# EAGLE design clock-kit-board-002 (EAGLE 8.5.2)
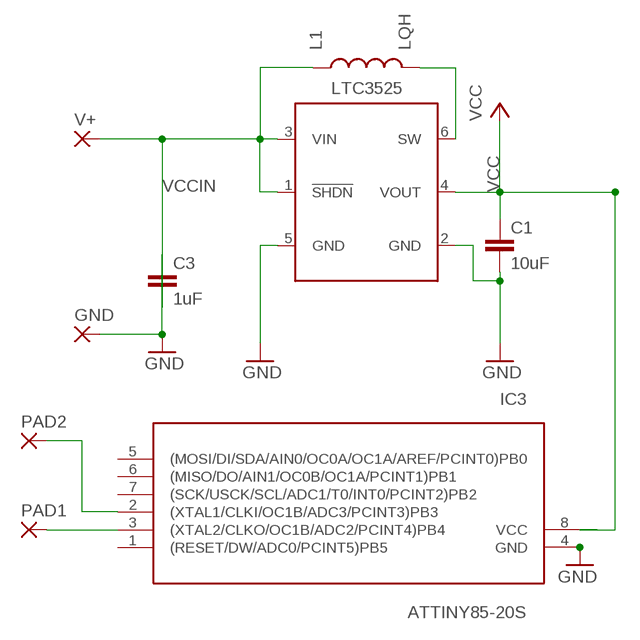
[diagram p0: schematic, sheet 1]

## Parts
C1  10uF  CAP0805  [0805]
C3  1uF  CAP0805  [0805]
GND  SMD5  [SMD2,54-5,08]
IC3  ATTINY85-20S  ATTINY85V-10S  [SOIC8]
L1  LQH  [LQH32]
PAD1  1,6/0,9  [1,6/0,9]
PAD2  1,6/0,9  [1,6/0,9]
U1  LTC3525  [SC70-6L]
V+  SMD5  [SMD2,54-5,08]

## Nets
GND: C1.2 C3.1 GND.1(P) IC3.4(GND) U1.2(GND) U1.5(GND)
N$1: L1.2 U1.6(SW)
N$2: IC3.3((XTAL2/CLKO/OC1B/ADC2/PCINT4)PB4) PAD1.1(P)
N$3: IC3.2((XTAL1/CLKI/OC1B/ADC3/PCINT3)PB3) PAD2.1(P)
VCC: C1.1 IC3.8(VCC) U1.4(VOUT)
VCCIN: C3.2 L1.1 U1.1(!SHDN) U1.3(VIN) V+.1(P)
Unconnected: IC3.1((RESET/DW/ADC0/PCINT5)PB5) IC3.5((MOSI/DI/SDA/AIN0/OC0A/OC1A/AREF/PCINT0)PB0) IC3.6((MISO/DO/AIN1/OC0B/OC1A/PCINT1)PB1) IC3.7((SCK/USCK/SCL/ADC1/T0/INT0/PCINT2)PB2)

## Library data of the parts
C1 C3 = 0-SparkFun:CAP: Capacitor Standard 0603 ceramic capacitor, and 0.1" leaded capacitor.
GND V+ = wirepad:SMD5: SMD PAD
IC3 = avr:ATTINY85: MICROCONTROLLER 8 Kbytes FLASH 512 bytes EEPROM 512 bytes RAM 4-channel 10 bit ADC USI
L1 = murata-inductor:LQH: Murata LQH32 inductor
PAD1 PAD2 = wirepad:1,6/0,9: THROUGH-HOLE PAD
U1 = bicyclelab:LTC3525

## Board
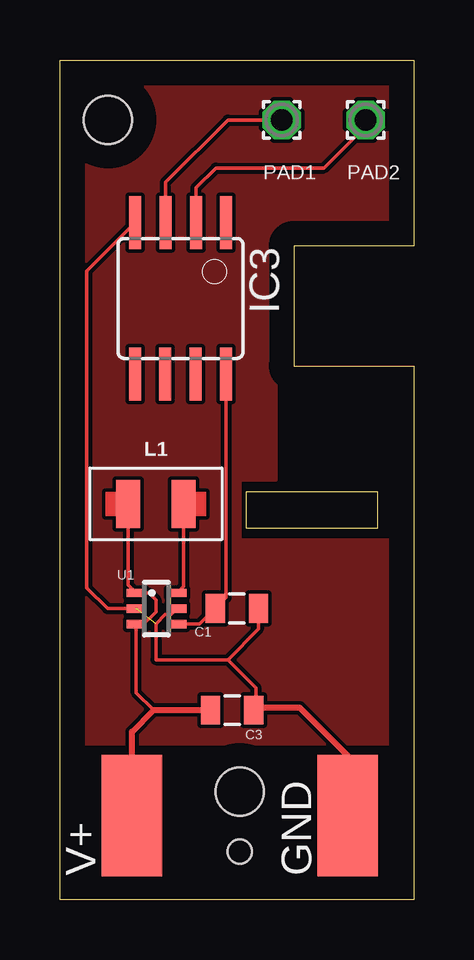
[diagram p1: board, top side]

Size 14.75 x 35 mm. Coordinates in mm from the lower left corner, seen from the top.
Outline: 0,35 14.75,35 14.75,27.25 9.75,27.25 9.75,22.25 14.75,22.25 14.75,0 0,0 0,35
Copper layers (1*16): Top 0.035mm / dielectric 1.5mm / Bottom 0.035mm
Design rules "default": minimum track width 6mil, minimum drill 0.35mm, track to track 6mil, track to pad 6mil, pad to pad 6mil, via to via 6mil, smd to smd 6mil, copper to edge 40mil, drill to drill 6mil, minimum pad ring 10mil, minimum via ring 8mil, stop-mask expansion 4mil, vias tented up to drill 0mil, thermal gap 10mil
Holes 2 mm at 7.5,4.5 2,32.5
Holes 1 mm at 7.5,2
Milling: area 7.8,15.5 to 13.2,17

### Footprints (pad centres in the part's own frame; a part is rotated, then mirrored left to right if it is on the bottom)
0805 = smd 0.8 x 1.2: 1 -0.9,0; 2 0.9,0
SMD2,54-5,08 = smd 2.54 x 5.08: 1 0,0
SOIC8 = smd 0.5 x 2.2: 1 -1.905,-3.154; 2 -0.645,-3.154; 3 0.625,-3.154; 4 1.895,-3.154; 5 1.905,3.154; 6 0.635,3.154; 7 -0.635,3.154; 8 -1.905,3.154
LQH32 = smd 1 x 2: 1 -1.15,0; 2 1.15,0
1,6/0,9 = drill 0.914 pad 1.6 octagon: 1 0,0
SC70-6L = smd 0.35 x 0.8: 1 -0.65,-0.85; 2 0,-0.85; 3 0.65,-0.85; 4 0.65,0.85; 5 0,0.85; 6 -0.65,0.85

### Placement (x,y rotation side)
C1  7.38,12.13 0 top
C3  7.18,7.9 180 top
GND  12,3.5 0 top
IC3  5.03,25.06 180 top
L1  4,16.5 0 top
PAD1  9.25,32.5 0 top
PAD2  12.75,32.5 0 top
U1  4.03,12.13 270 top
V+  3,3.5 0 top

### Tracks (layer width: path | path; a pad name or v marks a point on that pad's centre or on a via)
GND  (1 unrouted)
  Top 0.152: IC3.4 1.12,26.2 1.12,13 1.99,12.13 U1.2 | U1.5 4.63,11.88 4.38,11.88 4,11.5 4,10 7,10 | 8.18,8 8.18,8.82 7,10 | C1.2 8.28,11.28 7,10
  Top 0.254: GND.1 12,6 10,8 8.18,8 C3.1
N$1
  Top 0.152: L1.2 5.15,13.05 U1.6
N$2
  Top 0.152: IC3.3 4.41,29.91 7,32.5 PAD1.1
N$3
  Top 0.152: IC3.2 5.67,29.68 6.5,30.5 11,30.5 12.75,32.25 PAD2.1
N$4
  pour Top: 0.5,34.5 0.5,6.5 14,6.5 14,15 7.5,15 7.5,17.5 9,17.5 9,28 14,28 14,34.5
VCC
  Top 0.152: IC3.8 6.93,12.59 6.67,12.32 C1.1 5.83,11.48 U1.4
VCCIN
  Top 0.152: L1.1 2.85,13.11 U1.1 3.72,12.78 4,12.5 4,12 3.48,11.48 U1.3 3.18,8.62 3.9,7.9
  Top 0.254: V+.1 3,7 3.9,7.9 C3.2

### Text on the board
bNames: Clockit board v2 / t.igoe / 22 Jun 2019